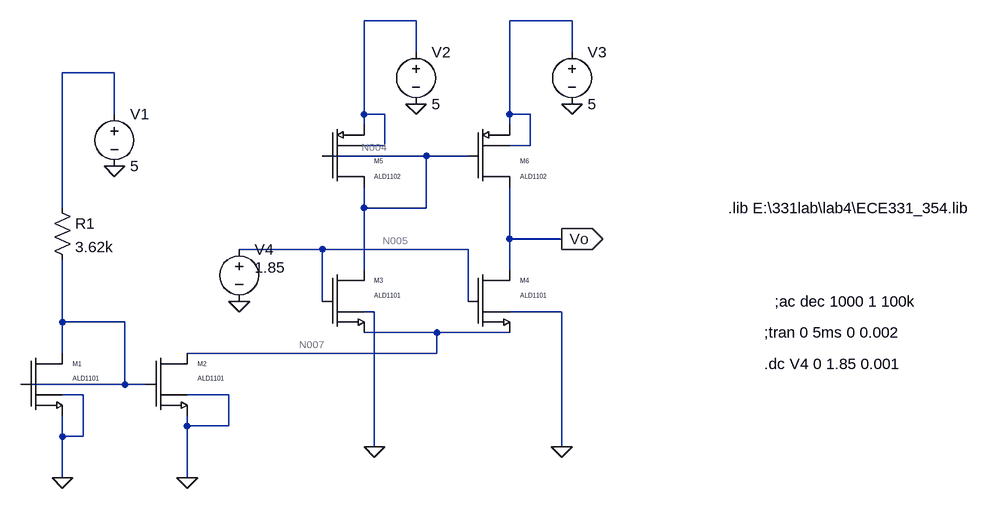
[diagram p0: schematic lab4.asc]
lab4.asc, the LTspice schematic file:
Version 4
SHEET 1 1304 680
WIRE 384 -240 304 -240
WIRE 624 -240 528 -240
WIRE 384 -192 384 -240
WIRE 624 -192 624 -240
WIRE -80 -160 -160 -160
WIRE -80 -96 -80 -160
WIRE 304 -96 304 -240
WIRE 336 -96 304 -96
WIRE 528 -96 528 -240
WIRE 560 -96 528 -96
WIRE 304 -80 304 -96
WIRE 528 -80 528 -96
WIRE 336 -48 336 -96
WIRE 336 -48 304 -48
WIRE 560 -48 560 -96
WIRE 560 -48 528 -48
WIRE 400 -32 240 -32
WIRE 464 -32 400 -32
WIRE -160 48 -160 -160
WIRE 304 48 304 16
WIRE 400 48 400 -32
WIRE 400 48 304 48
WIRE 528 96 528 16
WIRE 608 96 528 96
WIRE 240 112 112 112
WIRE 464 112 240 112
WIRE 304 144 304 48
WIRE 528 144 528 96
WIRE 240 192 240 112
WIRE 464 192 464 112
WIRE 320 208 304 208
WIRE 608 208 528 208
WIRE -160 224 -160 128
WIRE -64 224 -160 224
WIRE 416 240 304 240
WIRE 528 240 416 240
WIRE -160 272 -160 224
WIRE 416 272 416 240
WIRE 416 272 32 272
WIRE -64 320 -64 224
WIRE -64 320 -224 320
WIRE -32 320 -64 320
WIRE -128 336 -160 336
WIRE 96 336 32 336
WIRE 32 384 32 368
WIRE 96 384 96 336
WIRE 96 384 32 384
WIRE -160 400 -160 368
WIRE -128 400 -128 336
WIRE -128 400 -160 400
WIRE 320 416 320 208
WIRE 608 416 608 208
WIRE -160 464 -160 400
WIRE 32 464 32 384
FLAG -160 464 0
FLAG 32 464 0
FLAG 320 416 0
FLAG 608 416 0
FLAG 608 96 Vo
IOPIN 608 96 Out
FLAG 384 -112 0
FLAG 624 -112 0
FLAG -80 -16 0
FLAG 112 192 0
SYMBOL ALD1101 -224 272 R0
SYMATTR InstName M1
SYMBOL ALD1101 -32 272 R0
SYMATTR InstName M2
SYMBOL ALD1101 240 144 R0
SYMATTR InstName M3
SYMBOL ALD1101 464 144 R0
SYMATTR InstName M4
SYMBOL ALD1102 240 -80 R0
SYMATTR InstName M5
SYMBOL ALD1102 464 -80 R0
SYMATTR InstName M6
SYMBOL voltage -80 -112 R0
WINDOW 123 0 0 Left 2
WINDOW 39 0 0 Left 2
SYMATTR InstName V1
SYMATTR Value 5
SYMBOL voltage 384 -208 R0
WINDOW 123 0 0 Left 2
WINDOW 39 0 0 Left 2
SYMATTR InstName V2
SYMATTR Value 5
SYMBOL voltage 624 -208 R0
WINDOW 123 0 0 Left 2
WINDOW 39 0 0 Left 2
SYMATTR InstName V3
SYMATTR Value 5
SYMBOL res -176 32 R0
SYMATTR InstName R1
SYMATTR Value 3.62k
SYMBOL voltage 112 96 R0
WINDOW 3 24 44 Left 2
WINDOW 123 24 72 Left 2
WINDOW 39 0 0 Left 2
SYMATTR InstName V4
SYMATTR Value 1.85
TEXT 864 48 Left 2 !.lib E:\\331lab\\lab4\\ECE331_354.lib
TEXT 920 240 Left 2 !;tran 0 5ms 0 0.002
TEXT 936 192 Left 2 !;ac dec 1000 1 100k
TEXT 920 288 Left 2 !.dc V4 0 1.85 0.001

The netlist it stands for:
* lab4.asc
M1 N006 N006 0 0 ALD1101 W=1.379e-3 L=1E-6
M2 N007 N006 0 0 ALD1101 W=1.379e-3 L=1E-6
M3 N004 N005 N007 0 ALD1101 W=1.379e-3 L=1E-6
M4 Vo N005 N007 0 ALD1101 W=1.379e-3 L=1E-6
M5 N004 N004 N001 N001 ALD1102 W=1.739e-3 L=1e-6
M6 Vo N004 N002 N002 ALD1102 W=1.739e-3 L=1e-6
V1 N003 0 5
V2 N001 0 5
V3 N002 0 5
R1 N003 N006 3.62k
V4 N005 0 1.85
.model NMOS NMOS
.model PMOS PMOS
.lib standard.mos
.lib E:\331lab\lab4\ECE331_354.lib
;tran 0 5ms 0 0.002
;ac dec 1000 1 100k
.dc V4 0 1.85 0.001
.backanno
.end

* Results of the author's LTspice run, read from the files saved beside the schematic
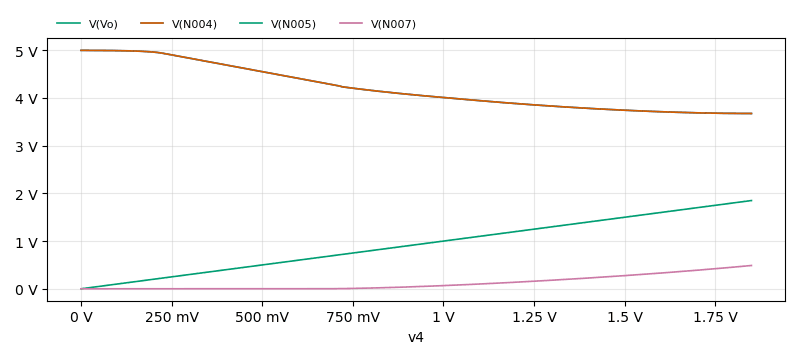
[diagram p1: DC transfer characteristic of lab4.asc, plotted from the saved traces]
* DC transfer characteristic, 1 run:
*   V(Vo): 4.998 V at v4=0 V, 3.675 V at v4=1.85 V, min 3.675 V, max 4.998 V
*   V(N004): 4.998 V at v4=0 V, 3.675 V at v4=1.85 V, min 3.675 V, max 4.998 V
*   V(N005): 0 V at v4=0 V, 1.85 V at v4=1.85 V, min 0 V, max 1.85 V
*   V(N007): 8.149 nV at v4=0 V, 488.6 mV at v4=1.85 V, min 8.149 nV, max 488.6 mV